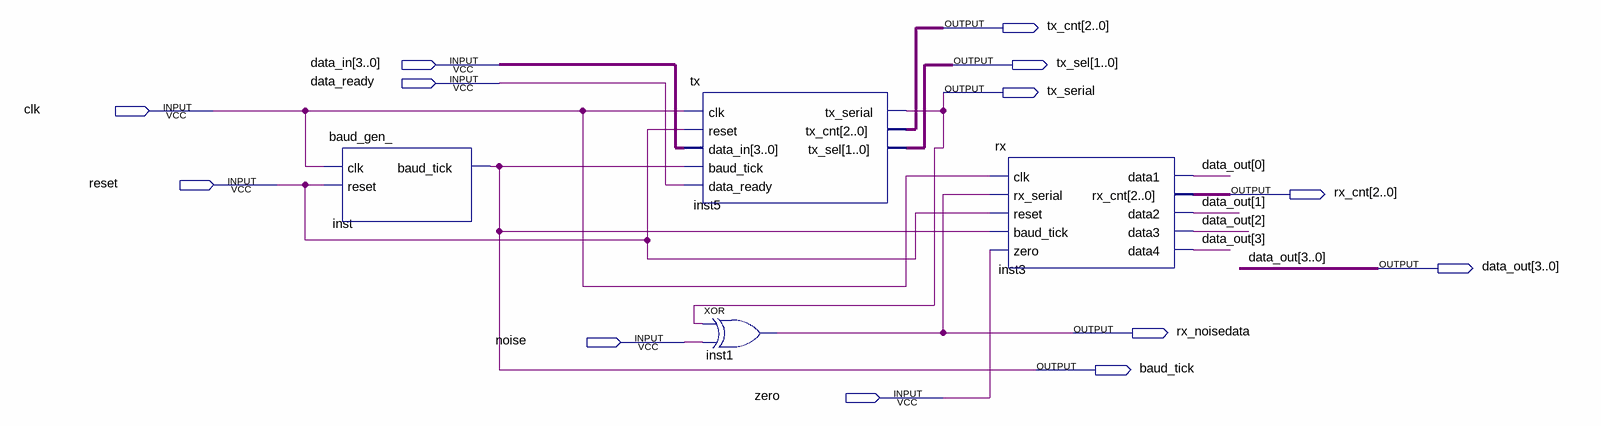
[diagram p0: schematic sheet]
// Quartus schematic top.bdf as structural Verilog: 4 symbols, 13 pins
module top (
  input  [3:0] data_in,
  input  data_ready,
  input  clk,
  input  reset,
  input  noise,
  input  zero,
  output [2:0] tx_cnt,
  output [1:0] tx_sel,
  output tx_serial,
  output [2:0] rx_cnt,
  output [3:0] data_out,
  output rx_noisedata,
  output baud_tick
);

  baud_gen_ inst (.clk(clk), .reset(reset), .baud_tick(baud_tick));
  tx inst5 (
    .clk(clk), .reset(reset), .data_in(data_in), .baud_tick(baud_tick), .data_ready(data_ready),
    .tx_serial(tx_serial), .tx_cnt(tx_cnt), .tx_sel(tx_sel));
  xor inst1 (rx_noisedata, tx_serial, noise);
  rx inst3 (
    .clk(clk), .rx_serial(rx_noisedata), .reset(reset), .baud_tick(baud_tick), .zero(zero),
    .data1(data_out[0]), .rx_cnt(rx_cnt), .data2(data_out[1]), .data3(data_out[2]), .data4(data_out[3]));
endmodule
